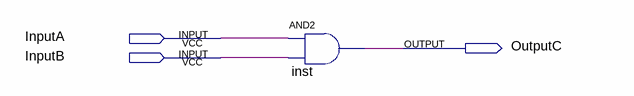
[diagram p0: schematic sheet]
// Quartus schematic TwoInput_AndGate.bdf as structural Verilog: 1 symbols, 3 pins
module TwoInput_AndGate (
  input  InputA,
  input  InputB,
  output OutputC
);

  and inst (OutputC, InputA, InputB);
endmodule
